# Altium project AirConditioning1.2.PrjPCB
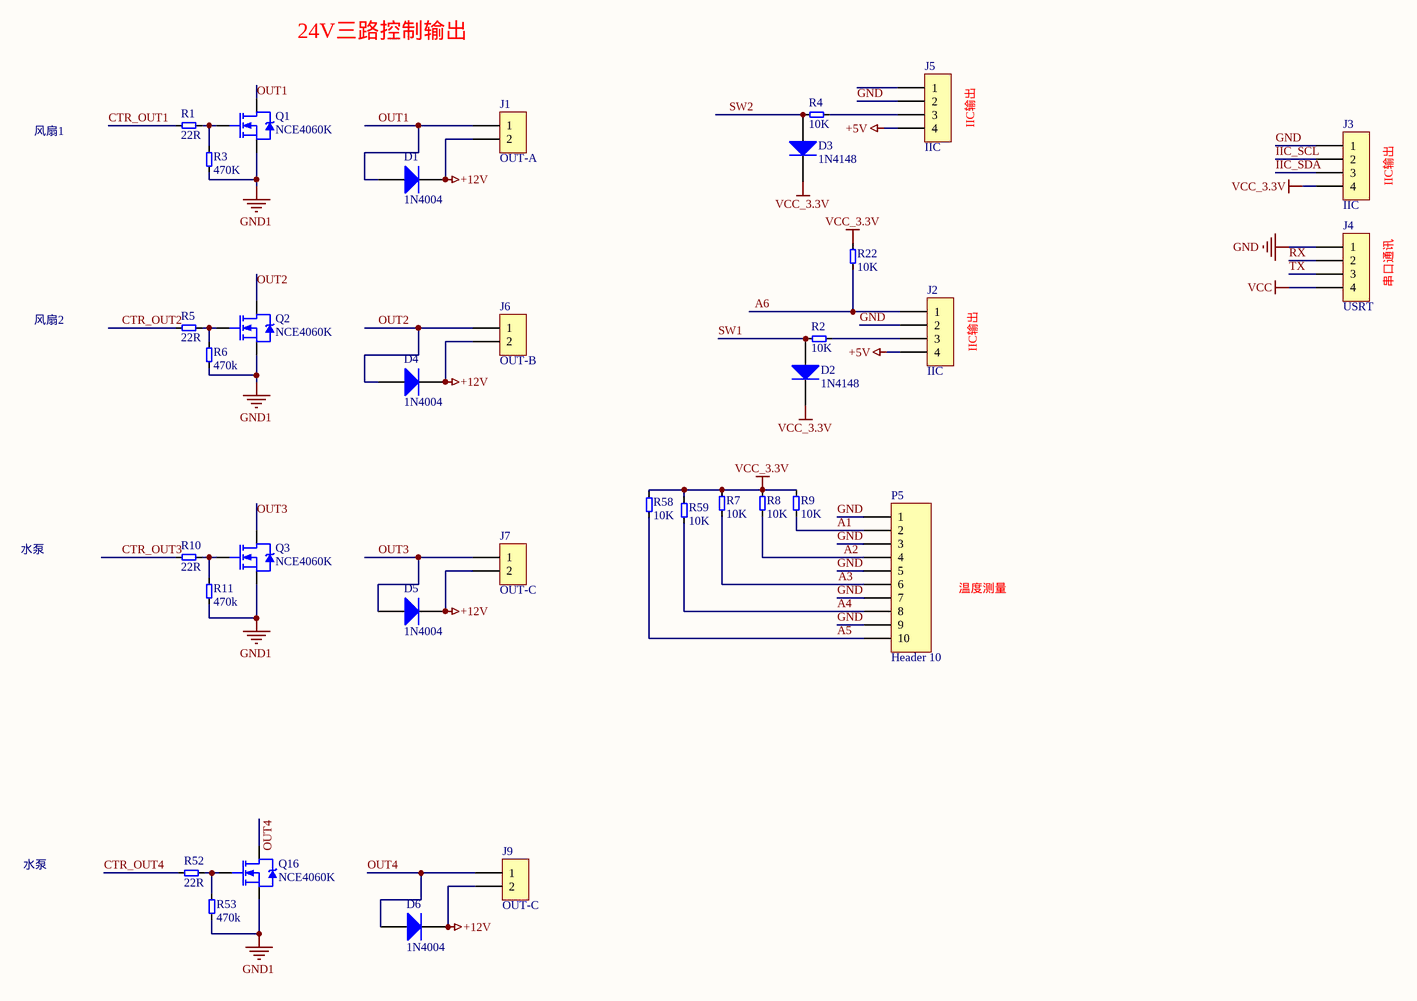
[diagram p0: Connector.SchDoc]
4 sheets, 158 parts. Net scope: global (net labels, ports and power ports of the same name join across sheets).
Board file: PCB1.PcbDoc
Sheets:
  Connector.SchDoc
  cpu.SchDoc
  Humidifier.SchDoc
  POWER.SchDoc

## Sheet Connector.SchDoc
size A3

### Parts
D1  1N4004  [D7227]
D2  1N4148  [sod323]
D3  1N4148  [sod323]
D4  1N4004  [D7227]
D5  1N4004  [D7227]
D6  1N4004  [D7227]
J1  OUT-A  [SIP-2L]
J2  IIC  [SIP-4L]
J3  IIC  [SIP-4L]
J4  USRT  [SIP-4L]
J5  IIC  [SIP-4L]
J6  OUT-B  [SIP-2L]
J7  OUT-C  [SIP-2L]
J9  OUT-C  [SIP-2L]
P5  Header 10  [SIP-10L]
Q1  NCE4060K  [TO-252-3S]
Q2  NCE4060K  [TO-252-3S]
Q3  NCE4060K  [TO-252-3S]
Q16  NCE4060K  [TO-252-3S]
R1  22R  [0805R]
R2  10K  [0805R]
R3  470K  [0805R]
R4  10K  [0805R]
R5  22R  [0805R]
R6  470k  [0805R]
R7  10K  [0805R]
R8  10K  [0805R]
R9  10K  [0805R]
R10  22R  [0805R]
R11  470k  [0805R]
R22  10K  [0805R]
R52  22R  [0805R]
R53  470k  [0805R]
R58  10K  [0805R]
R59  10K  [0805R]

### Nets
+5V: J2.4 J5.4
+12V: D1.K D4.K D5.K D6.K J1.2 J6.2 J7.2 J9.2
GND: J2.2 J3.1 J4.1 J5.2 P5.1 P5.3 P5.5 P5.7 P5.9 Q1.3(S) Q2.3(S) Q3.3(S) Q16.3(S) R3.1 R6.1 R11.1 R53.1  [also labelled GND1]
VCC: J4.4
VCC_3.3V: D2.K D3.K J3.4 R7.2 R8.2 R9.2 R22.2 R58.2 R59.1
A1: P5.2 R9.1
A2: P5.4 R8.1
A3: P5.6 R7.1
A4: P5.8 R59.2
A5: P5.10 R58.1
A6: J2.1 R22.1
CTR_OUT1: R1.1
CTR_OUT2: R5.1
CTR_OUT3: R10.1
CTR_OUT4: R52.1
IIC_SCL: J3.2
IIC_SDA: J3.3
OUT1: D1.A J1.1 Q1.2(D)
OUT2: D4.A J6.1 Q2.2(D)
OUT3: D5.A J7.1 Q3.2(D)
OUT4: D6.A J9.1 Q16.2(D)
RX: J4.2
SW1: D2.A R2.2
SW2: D3.A R4.2
TX: J4.3
NetJ2_3: J2.3 R2.1
NetJ5_3: J5.3 R4.1
NetQ1_1: Q1.1(G) R1.2 R3.2
NetQ2_1: Q2.1(G) R5.2 R6.2
NetQ3_1: Q3.1(G) R10.2 R11.2
NetQ16_1: Q16.1(G) R52.2 R53.2

Not connected (* = marked no-connect by the designer): J5 1

### Notes on the sheet
- 24V三路控制输出
- 风扇1
- (near J5) IIC输出
- (near J3) IIC输出
- (near J4) 串口通讯
- 风扇2
- (near J2) IIC输出
- 水泵
- 温度测量

### Library data of the parts
D1 D4-D6 = Diode_2: Default Diode; Published: 8-Jun-2000; LatestRevisionDate: 17-Jul-2002; LatestRevisionNote: Re-released for DXP Platform.; PackageVersion: Sep-1996; PackageReference: SMC; Publisher: Altium Limited; PackageDescription: DO-214-AB/SMC; 2 C-Bend Leads; Body 7.9 x 5.9 mm, inc. leads (LxW); Code_JEDEC: DO-214-AB
D2 D3 = Diode: Default Diode; Published: 8-Jun-2000; LatestRevisionDate: 17-Jul-2002; LatestRevisionNote: Re-released for DXP Platform.; PackageVersion: Sep-1996; PackageReference: SMC; Publisher: Altium Limited; Code_JEDEC: DO-214-AB
J1 J6 J7 J9 = CON2: Connector
J2-J5 = SIP4-2.54: CN-SIP4-2.54
P5 = Header 10: Header, 10-Pin; LatestRevisionDate: 17-Jul-2002; LatestRevisionNote: Re-released for DXP Platform.; Publisher: Altium Limited
Q1-Q3 Q16 = NCE4060K: NMOSFET
R1-R11 R22 R52 R53 R58 R59 = 1K: CR85-102J

## Sheet cpu.SchDoc
size A3
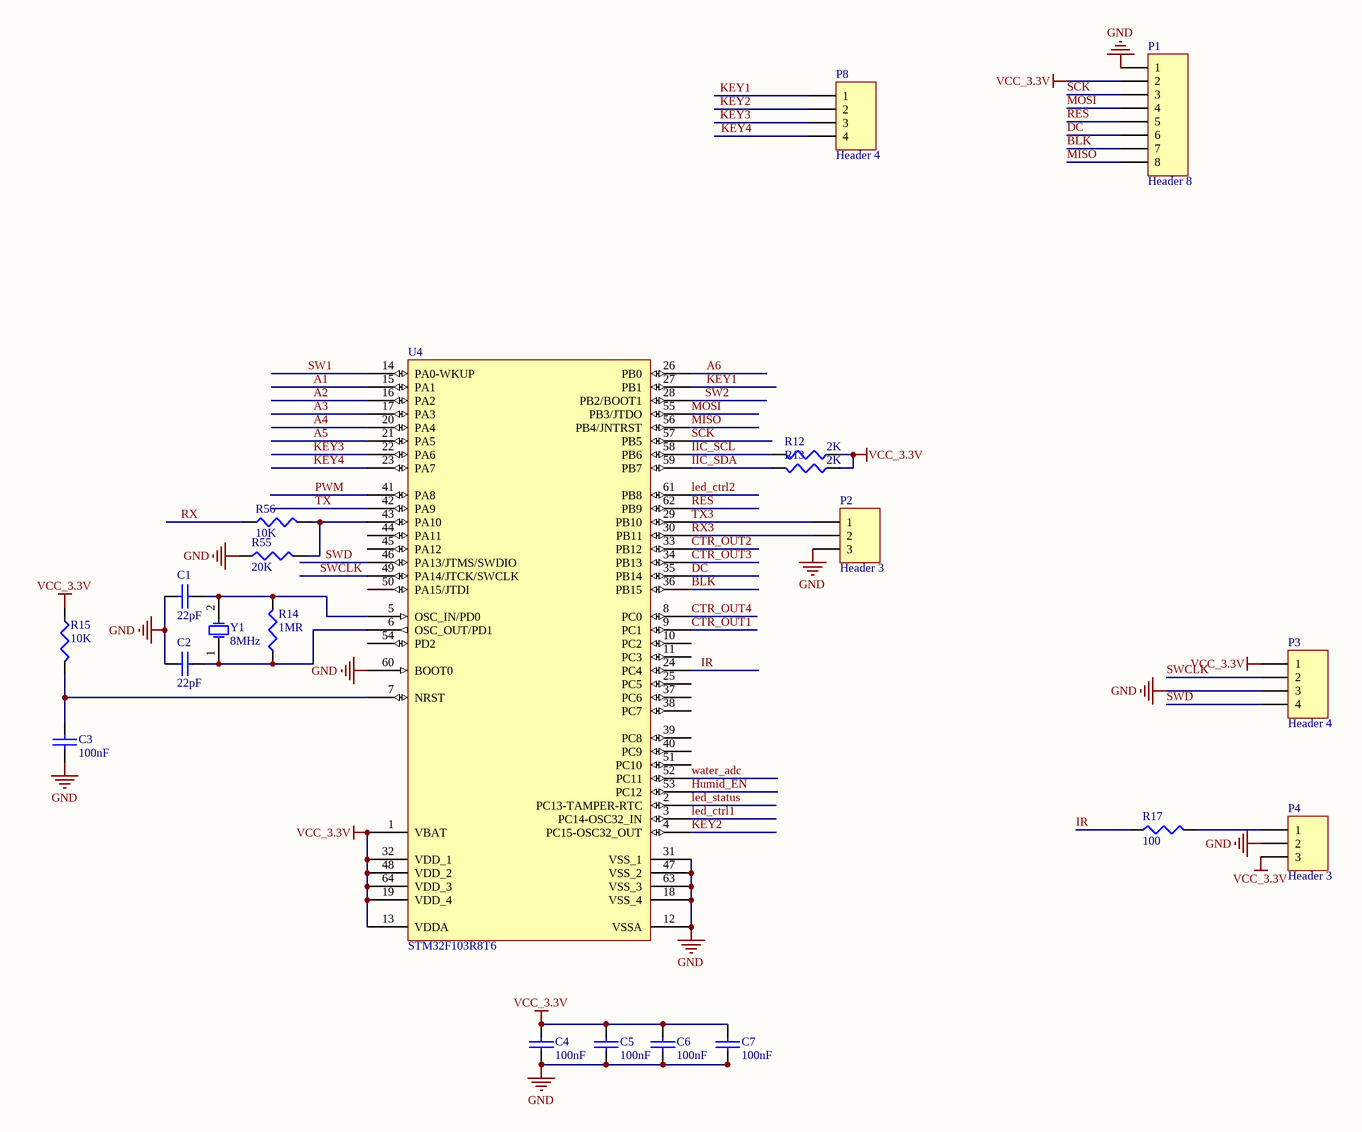
[diagram p1: cpu.SchDoc]

### Parts
C1  22pF  [0805c]
C2  22pF  [0805c]
C3  100nF  [0805c]
C4  100nF  [0805c]
C5  100nF  [0805c]
C6  100nF  [0805c]
C7  100nF  [0805c]
P1  Header 8  [HDR1X8]
P2  Header 3  [HDR1X3]
P3  Header 4  [HDR1X4]
P4  Header 3  [HDR1X3]
P8  Header 4  [HDR1X4]
R12  2K  [0805R]
R13  2K  [0805R]
R14  1MR  [0805R]
R15  10K  [0805R]
R17  100  [0805R]
R55  20K  [0805R]
R56  10K  [0805R]
U4  STM32F103R8T6  [LQFP-64]
Y1  8MHz  [SMT5032]

### Nets
GND: C1.1 C2.1 C3.1 C4.1 C5.1 C6.1 C7.1 P1.1 P2.3 P3.3 P4.2 R55.1 U4.12(VSSA) U4.18(VSS_4) U4.31(VSS_1) U4.47(VSS_2) U4.60(BOOT0) U4.63(VSS_3)
VCC_3.3V: C4.2 C5.2 C6.2 C7.2 P1.2 P3.1 P4.3 R12.1 R13.1 R15.1 U4.1(VBAT) U4.13(VDDA) U4.19(VDD_4) U4.32(VDD_1) U4.48(VDD_2) U4.64(VDD_3)
A1: U4.15(PA1)
A2: U4.16(PA2)
A3: U4.17(PA3)
A4: U4.20(PA4)
A5: U4.21(PA5)
A6: U4.26(PB0)
BLK: P1.7 U4.36(PB15)
CTR_OUT1: U4.9(PC1)
CTR_OUT2: U4.33(PB12)
CTR_OUT3: U4.34(PB13)
CTR_OUT4: U4.8(PC0)
DC: P1.6 U4.35(PB14)
Humid_EN: U4.53(PC12)
IIC_SCL: R12.2 U4.58(PB6)
IIC_SDA: R13.2 U4.59(PB7)
IR: R17.1 U4.24(PC4)
KEY1: P8.1 U4.27(PB1)
KEY2: P8.2 U4.4(PC15-OSC32_OUT)
KEY3: P8.3 U4.22(PA6)
KEY4: P8.4 U4.23(PA7)
led_ctrl1: U4.3(PC14-OSC32_IN)
led_ctrl2: U4.61(PB8)
led_status: U4.2(PC13-TAMPER-RTC)
MISO: P1.8 U4.56(PB4/JNTRST)
MOSI: P1.4 U4.55(PB3/JTDO)
PWM: U4.41(PA8)
RES: P1.5 U4.62(PB9)
RX: R56.1
RX3: P2.2 U4.30(PB11)
SCK: P1.3 U4.57(PB5)
SW1: U4.14(PA0-WKUP)
SW2: U4.28(PB2/BOOT1)
SWCLK: P3.2 U4.49(PA14/JTCK/SWCLK)
SWD: P3.4 U4.46(PA13/JTMS/SWDIO)
TX: U4.42(PA9)
TX3: P2.1 U4.29(PB10)
water_adc: U4.52(PC11)
NetC1_2: C1.2 R14.2 U4.5(OSC_IN/PD0) Y1.2(OSC2)
NetC2_2: C2.2 R14.1 U4.6(OSC_OUT/PD1) Y1.1(OSC1)
NetC3_2: C3.2 R15.2 U4.7(NRST)
NetP4_1: P4.1 R17.2
NetR55_2: R55.2 R56.2 U4.43(PA10)

Not connected (* = marked no-connect by the designer): U4 10(PC2) 11(PC3) 25(PC5) 37(PC6) 38(PC7) 39(PC8) 40(PC9) 44(PA11) 45(PA12) 50(PA15/JTDI) 51(PC10) 54(PD2)

### Library data of the parts
C1-C7 = CAP: Capacitor
P1 = Header 8: Header, 8-Pin; LatestRevisionDate: 17-Jul-2002; LatestRevisionNote: Re-released for DXP Platform.; Publisher: Altium Limited
P2 P4 = Header 3: Header, 3-Pin; LatestRevisionDate: 17-Jul-2002; LatestRevisionNote: Re-released for DXP Platform.; Publisher: Altium Limited
P3 P8 = Header 4: Header, 4-Pin; LatestRevisionDate: 17-Jul-2002; LatestRevisionNote: Re-released for DXP Platform.; Publisher: Altium Limited
R12-R15 R17 R55 R56 = Res3: Resistor; Published: 8-Jun-2000; LatestRevisionDate: 29-May-2009; LatestRevisionNote: IPC-7351 Footprint Added.; PackageReference: J1-0603; Publisher: Altium Limited; PackageDescription: Chip Resistor
U4 = STM32F103R8T6: STM32 ARM-based 32-bit MCU with 64 Kbytes Flash, 64-pin LQFP, Industrial Temperature; Published: 30-May-2008; DatasheetVersion: rev6, Mar-2008; PackageVersion: Mar-2008; PackageReference: LQFP64; Publisher: Altium Limited; PackageDescription: 64-Pin Low-Profile Quad Flat Pack, 10 x 10 mm Body, 0.5 mm Pitch (LQFP64); ComponentLink1Description: Manufacturer Link; ComponentLink1URL: www.st.com/stm32; ComponentLink2Description: Datasheet; ComponentLink2URL: http://www.st.com/stonline/products/literature/ds/13587.pdf
Y1 = XTAL: Crystal Oscillator; Published: 8-Jun-2000; LatestRevisionDate: 17-Jul-2002; LatestRevisionNote: Re-released for DXP Platform.; PackageReference: R38; Publisher: Altium Limited; PackageDescription: Crystal, Thru-Hole; 2 Leads; Body 3.1 x 8.2 mm (Dia.xH)

## Sheet Humidifier.SchDoc
size A2
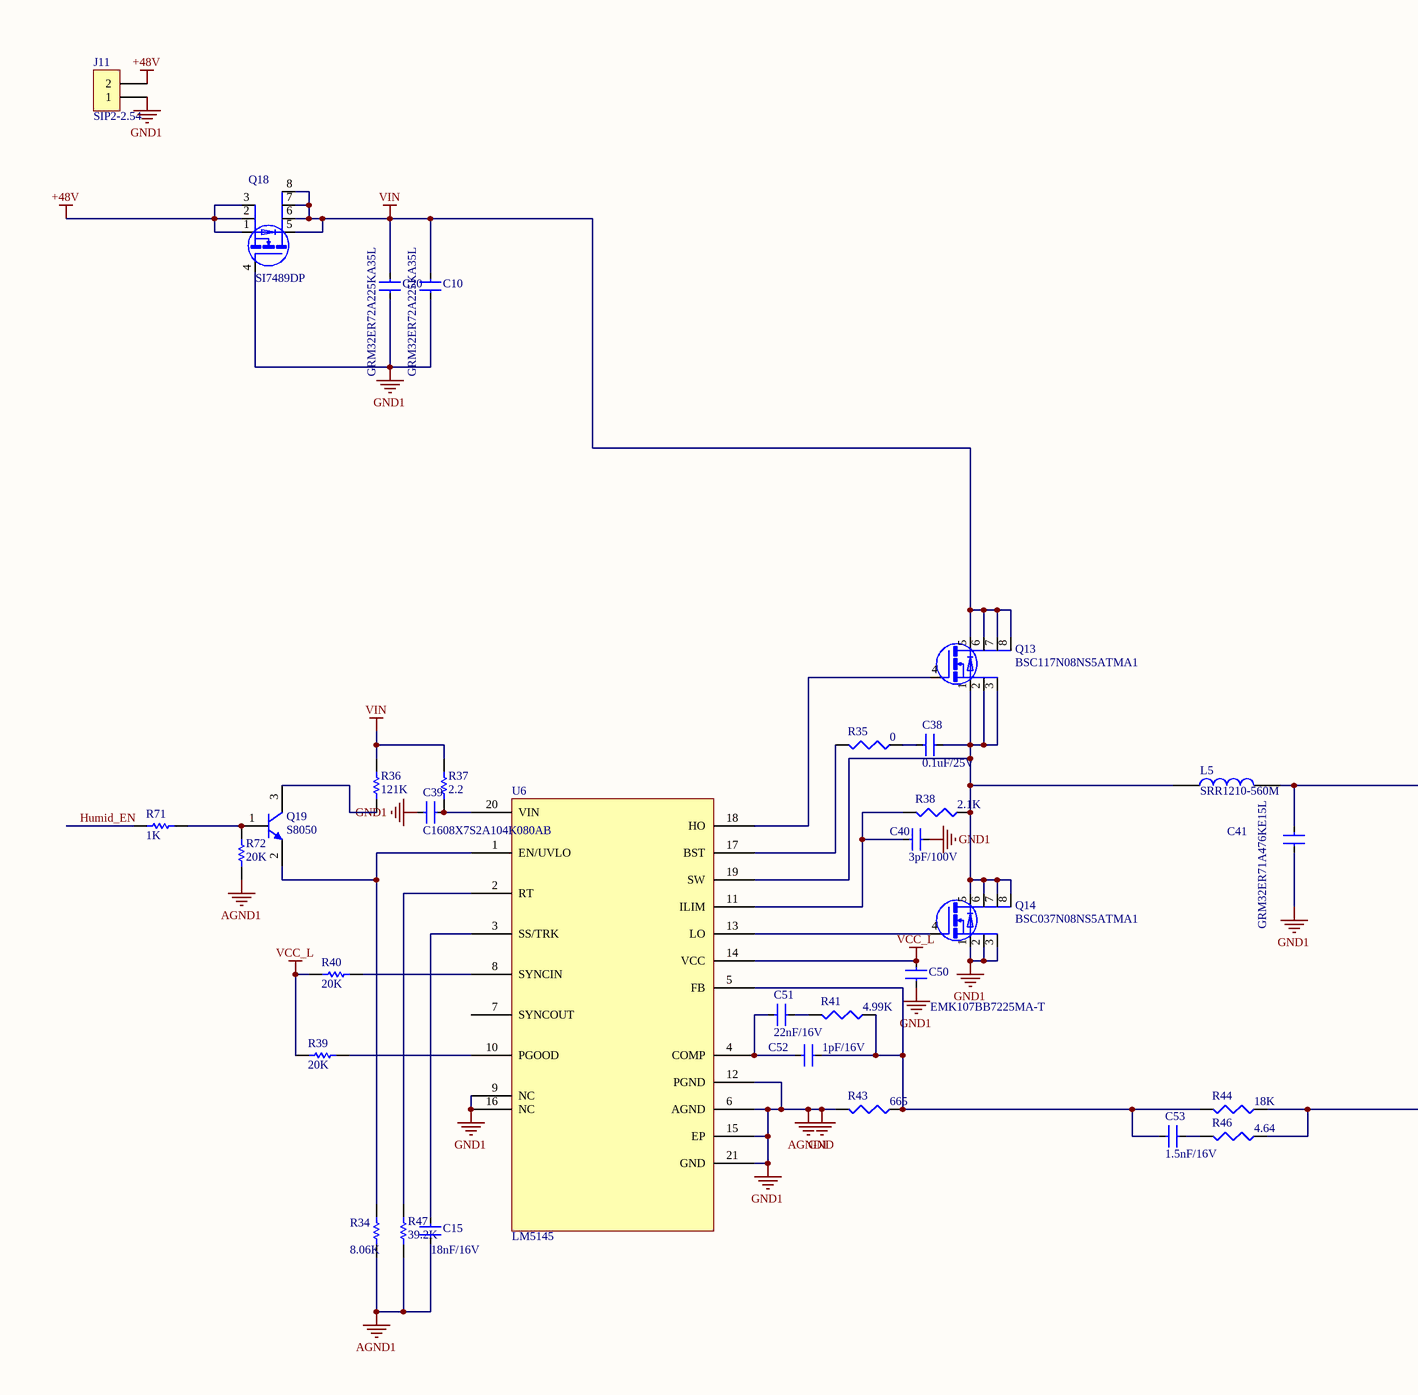
[diagram p2: Humidifier.SchDoc, left]
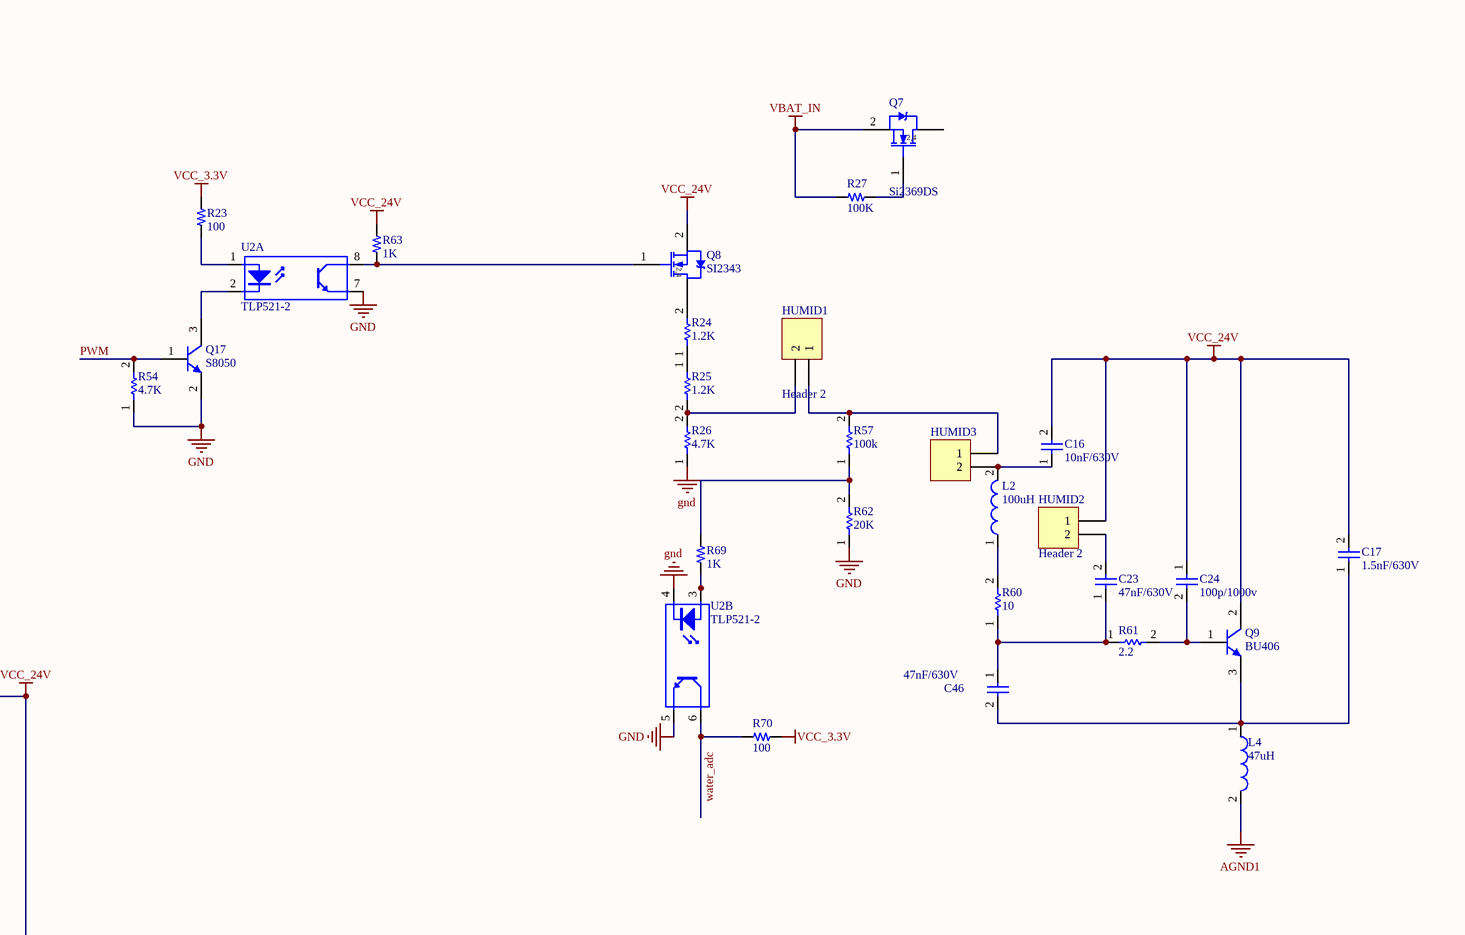
[diagram p3: Humidifier.SchDoc, right]

### Parts
(Parts that share a designator on the sheet are numbered #1, #2 ... from top to bottom, then left to right.)
C10  GRM32ER72A225KA35L  [1210C]
C15  18nF/16V  [0603C]
C16  10nF/630V  [CAP_5MM]
C17  1.5nF/630V  [AXIAL-0.3]
C20  GRM32ER72A225KA35L  [1210C]
C23  47nF/630V  [AXIAL-0.4]
C24  100p/1000v  [CAP_5MM]
C38  0.1uF/25V  [0603C]
C39  C1608X7S2A104K080AB  [0603C]
C40  3pF/100V  [0603C]
C41  GRM32ER71A476KE15L  [1210C]
C46  47nF/630V  [AXIAL-0.4]
C50  EMK107BB7225MA-T  [0603C]
C51  22nF/16V  [0603C]
C52  1pF/16V  [0603C]
C53  1.5nF/16V  [0603C]
HUMID1  Header 2  [SIP-2L]
HUMID2  Header 2  [SIP-2L]
HUMID3  (no value)  [SIP-2L]
J11  SIP2-2.54  [CH3.96-2P]
L2  100uH  [AXIAL-0.5]
L4  47uH  [6*8]
L5  SRR1210-560M  [SRR1210]
Q7  Si2369DS  [SOT23-3]
Q8  SI2343  [SOT23-3]
Q9  BU406  [to220]
Q13  BSC117N08NS5ATMA1  [PowerPAK SO-8]
Q14  BSC037N08NS5ATMA1  [PowerPAK SO-8]
Q17  S8050  [SOT23-3]
Q18  SI7489DP  [PowerPAK SO-8]
Q19  S8050  [SOT23-3]
R23  100  [0603R]
R24  1.2K  [AXIAL-0.4]
R25  1.2K  [AXIAL-0.4]
R26  4.7K  [AXIAL-0.4]
R27#1  100K  [0603R]
R34  8.06K  [0603R]
R35  0  [0603R]
R36  121K  [0805R]
R37  2.2  [0603R]
R38  2.1K  [0603R]
R39  20K  [0603R]
R40  20K  [0603R]
R41  4.99K  [0603R]
R43  665  [0603R]
R44  18K  [0603R]
R46  4.64  [0603R]
R47  39.2K  [0603R]
R54  4.7K  [0603r]
R57  100k  [0603r]
R60  10  [AXIAL-0.4]
R61  2.2  [AXIAL-0.4]
R62  20K  [0603r]
R63  1K  [0603R]
R69  1K  [0603R]
R70  100  [0603R]
R71  1K  [0603R]
R72  20K  [0603R]
U2  TLP521-2  [SO-8]  (parts A,B of 2)
U6  LM5145  [QFN050P600-8N]

### Nets
+48V: J11.2 Q18.1(S) Q18.2(S) Q18.3(S)
GND: C10.2 C15.2 C20.2 C39.1 C40.1 C41.2 C50.2 J11.1 L4.2 Q14.1(S) Q14.2(S) Q14.3(S) Q17.2(E) Q18.4(G) R26.1 R34.1 R43.2 R47.1 R54.1 R62.1 R72.2 U2.4(K) U2.5(E) U2.7(E) U6.6(AGND) U6.9(NC) U6.12(PGND) U6.15(EP) U6.16(NC) U6.21(GND)  [also labelled AGND1, GND1]
VBAT_IN: Q7.2(S) R27#1.1
VCC_3.3V: R23.2 R70.2
VCC_24V: C16.2 C17.2 C24.1 C41.1 HUMID2.1 L5.2 Q8.2(S) Q9.2(C) R44.1 R46.1 R63.2
VCC_L: C50.1 R39.2 R40.2 U6.14(VCC)
VIN: C10.1 C20.1 Q13.5(D) Q13.6(D) Q13.7(D) Q13.8(D) Q18.5(D) Q18.6(D) Q18.7(D) Q18.8(D) R36.2 R37.1
Humid_EN: R71.1
PWM: Q17.1(B) R54.2
water_adc: R70.1 U2.6(C)
NetC15_1: C15.1 U6.3(SS/TRK)
NetC16_1: C16.1 HUMID3.2 L2.2
NetC17_1: C17.1 C46.2 L4.1 Q9.3(E)
NetC23_1: C23.1 C46.1 R60.1 R61.1
NetC23_2: C23.2 HUMID2.2
NetC24_2: C24.2 Q9.1(B) R61.2
NetC38_1: C38.1 R35.1
NetC38_2: C38.2 L5.1 Q13.1(S) Q13.2(S) Q13.3(S) Q14.5(D) Q14.6(D) Q14.7(D) Q14.8(D) R38.1 U6.19(SW)
NetC39_2: C39.2 R37.2 U6.20(VIN)
NetC40_2: C40.2 R38.2 U6.11(ILIM)
NetC51_1: C51.1 C52.1 U6.4(COMP)
NetC51_2: C51.2 R41.2
NetC52_2: C52.2 C53.1 R41.1 R43.1 R44.2 U6.5(FB)
NetC53_2: C53.2 R46.2
NetHUMID1_1: HUMID1.1 HUMID3.1 R57.2
NetHUMID1_2: HUMID1.2 R25.2 R26.2
NetL2_1: L2.1 R60.2
NetQ7_1: Q7.1(G) R27#1.2
NetQ8_1: Q8.1(G) R63.1 U2.8(C)
NetQ8_3: Q8.3(D) R24.2
NetQ13_4: Q13.4(G) U6.18(HO)
NetQ14_4: Q14.4(G) U6.13(LO)
NetQ17_3: Q17.3(C) U2.2(K)
NetQ19_1: Q19.1(B) R71.2 R72.1
NetQ19_2: Q19.2(E) R34.2 U6.1(EN/UVLO)
NetQ19_3: Q19.3(C) R36.1
NetR23_1: R23.1 U2.1(A)
NetR24_1: R24.1 R25.1
NetR35_2: R35.2 U6.17(BST)
NetR39_1: R39.1 U6.10(PGOOD)
NetR40_1: R40.1 U6.8(SYNCIN)
NetR47_2: R47.2 U6.2(RT)
NetR57_1: R57.1 R62.2 R69.2
NetR69_1: R69.1 U2.3(A)

Not connected (* = marked no-connect by the designer): Q7 3(D); U6 7(SYNCOUT)

### Notes on the sheet
- (in symbol BUK92150-55A) 2,4

### Library data of the parts
C10 C15 C20 C38-C41 C50-C53 = 0.01UF: CCX85-103
C16 C17 C23 C24 C46 = Cap: Capacitor; Value: 1nF/100V; Published: 8-Jun-2000; LatestRevisionDate: 17-Jul-2002; LatestRevisionNote: Re-released for DXP Platform.; PackageReference: RAD-0.3; Publisher: Altium Limited
HUMID1-HUMID3 = Header 2: Header, 2-Pin; LatestRevisionDate: 17-Jul-2002; LatestRevisionNote: Re-released for DXP Platform.; Publisher: Altium Limited
J11 = SIP2-2.54: CN-SIP2-2.54
L2 L4 = Inductor: Code_IEC: 1005; Value: 10uH; Published: 8-Jun-2000; LatestRevisionDate: 29-May-2009; LatestRevisionNote: IPC-7351 Footprint Added.; PackageReference: 0402-A; Publisher: Altium Limited; PackageDescription: Chip Inductor; Code_JEITA: 0402
L5 = INDUCTOR
Q7 Q8 = BUK92150-55A: Published: 8-Jun-2000; LatestRevisionDate: 17-Jul-2002; LatestRevisionNote: Re-released for DXP Platform.; DatasheetVersion: 6-Oct-1997; PackageVersion: Aug-1998; PackageReference: TSOP-6; Publisher: Altium Limited; PackageDescription: SOT-457/SC-74; 6 Leads; Body 3.1 x 3 mm, inc. leads (LxW max); ComponentLink1Description: Manufacturer Link; ComponentLink1URL: http://www.vishay.com/; ComponentLink2Description: Datasheet; ComponentLink2URL: http://www.vishay.com/docs/70192/70192.pdf
Q9 = NPN: NPN Bipolar Transistor; Published: 8-Jun-2000; LatestRevisionDate: 17-Jul-2002; LatestRevisionNote: Re-released for DXP Platform.; PackageReference: TO-226; Publisher: Altium Limited; Code_JEDEC: TO-226-AA
Q13 Q14 Q18 = Si4004DY
Q17 Q19 = NPN
R23 R27#1 R63 R69 R70 = R
R24-R26 R34 R36 R37 R39 R40 R47 R54 R57 R60-R62 R72 = Res Semi: Semiconductor Resistor; Value: 1K; Published: 8-Jun-2000; LatestRevisionDate: 17-Jul-2002; LatestRevisionNote: Re-released for DXP Platform.; PackageReference: AXIAL-0.5; Publisher: Altium Limited
R35 R38 R41 R43 R44 R46 = Res3: Resistor; Published: 8-Jun-2000; LatestRevisionDate: 29-May-2009; LatestRevisionNote: IPC-7351 Footprint Added.; PackageReference: J1-0603; Publisher: Altium Limited; PackageDescription: Chip Resistor
R71 = Res Semi: Semiconductor Resistor; Published: 8-Jun-2000; LatestRevisionDate: 17-Jul-2002; LatestRevisionNote: Re-released for DXP Platform.; PackageReference: AXIAL-0.5; Publisher: Altium Limited; Value: 1K

## Sheet POWER.SchDoc
size A3
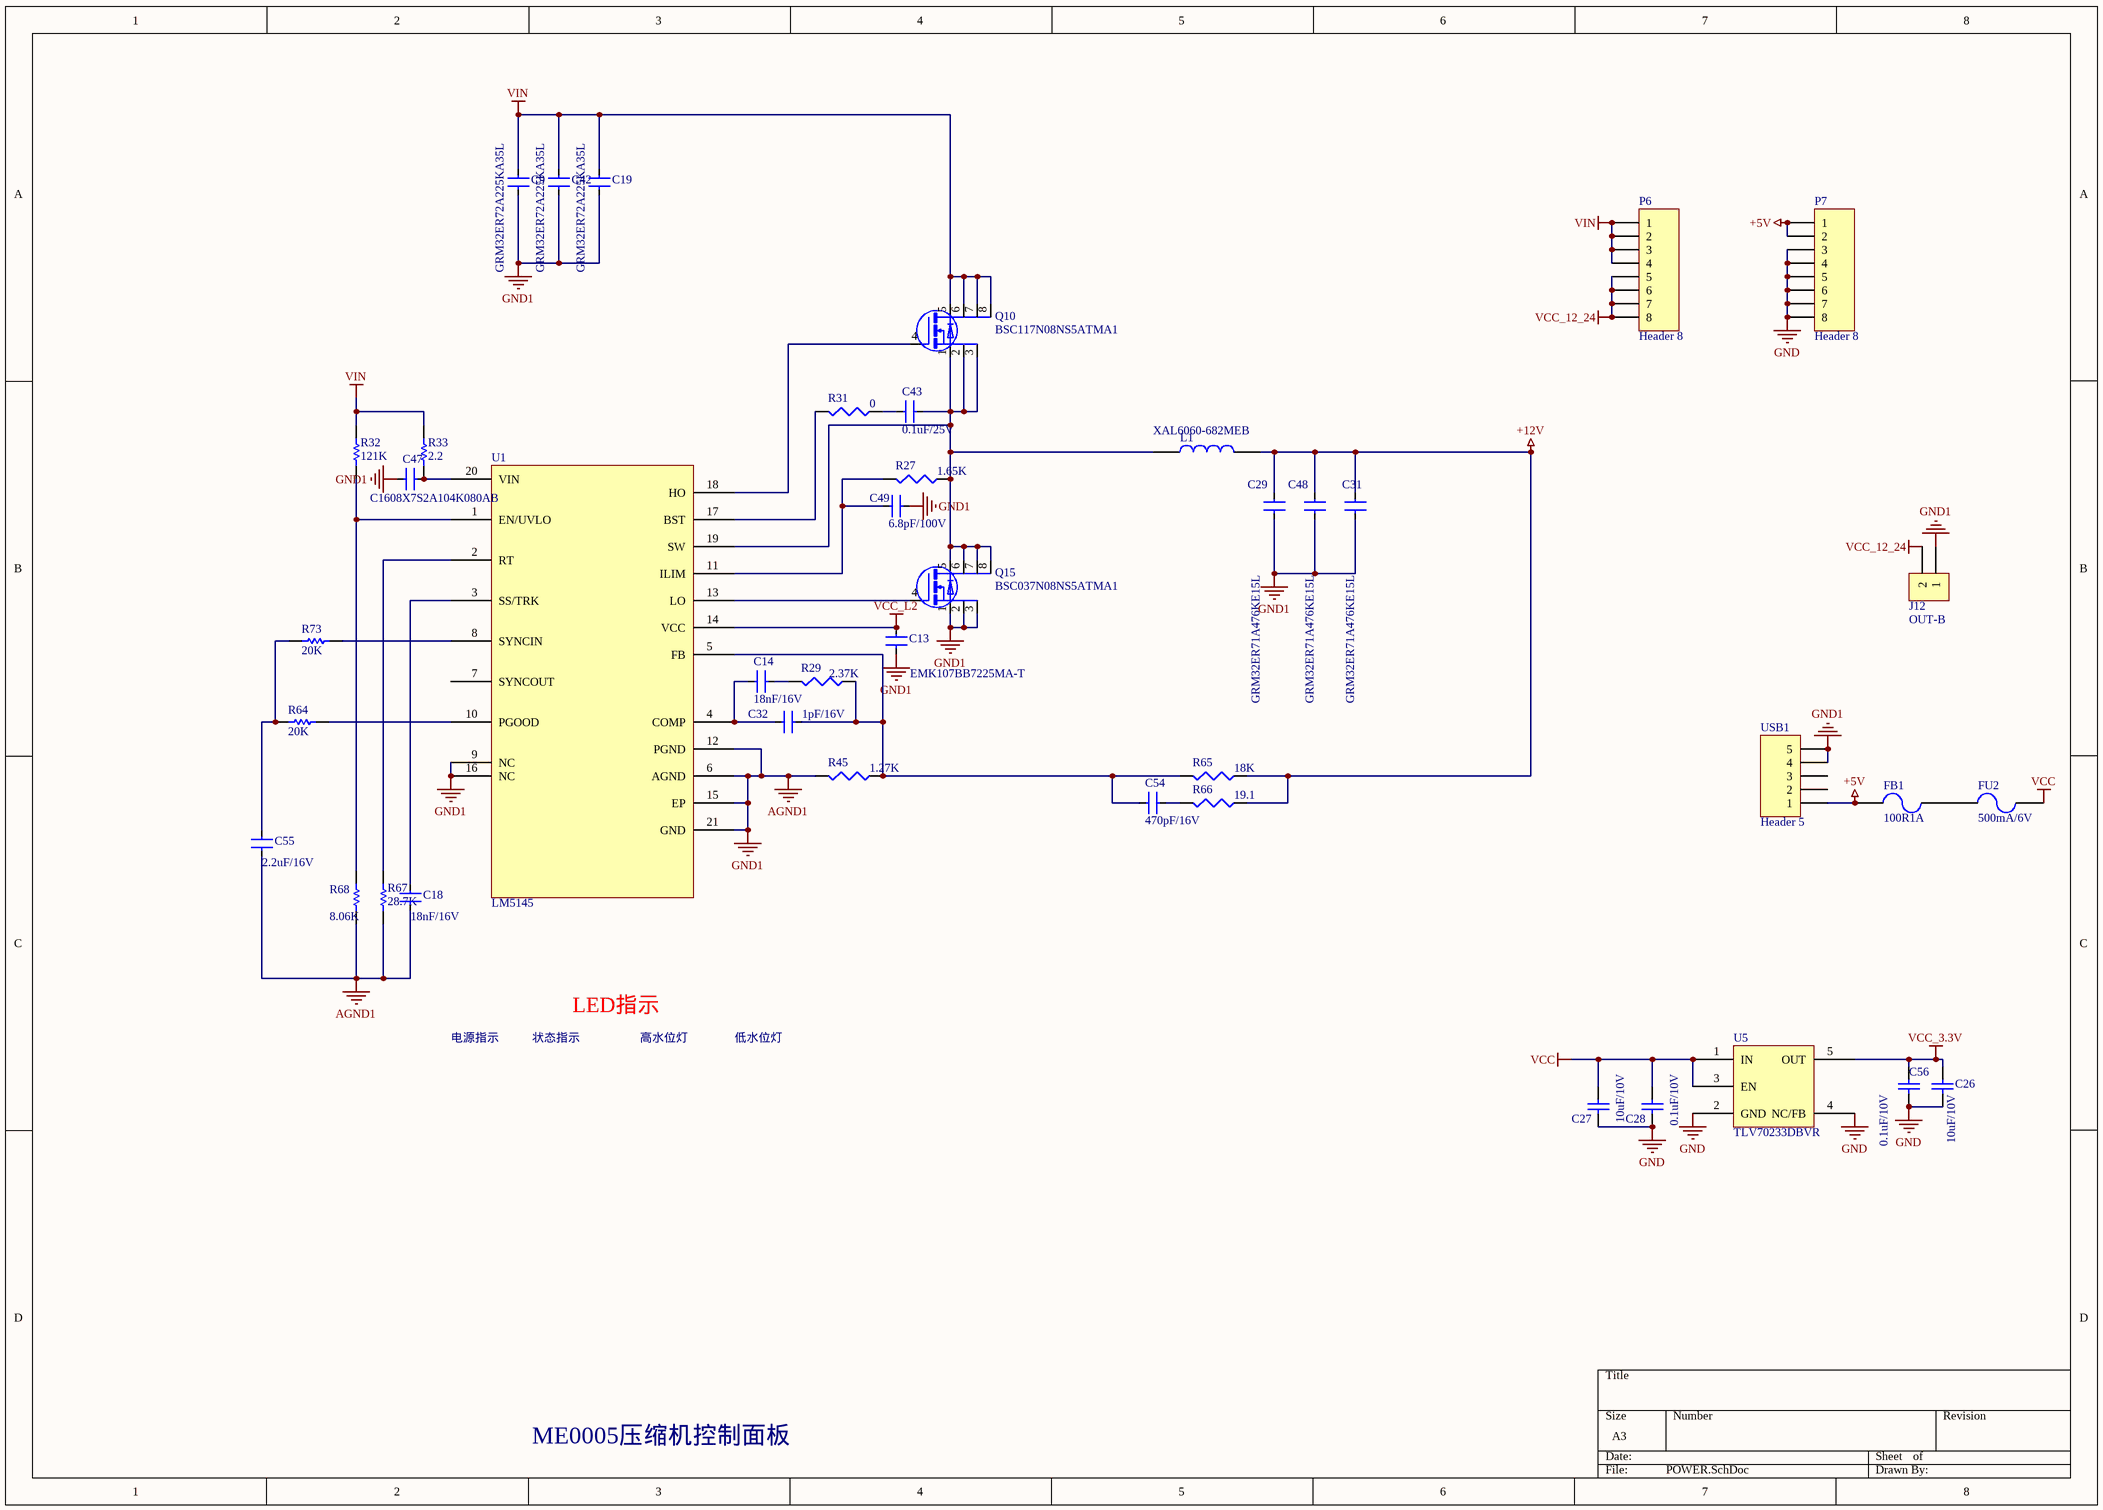
[diagram p4: POWER.SchDoc]

### Parts
(Parts that share a designator on the sheet are numbered #1, #2 ... from top to bottom, then left to right.)
C9  GRM32ER72A225KA35L  [1210C]
C13  EMK107BB7225MA-T  [0603C]
C14  18nF/16V  [0603C]
C18  18nF/16V  [0603C]
C19  GRM32ER72A225KA35L  [1210C]
C26  10uF/10V  [0603C]
C27  10uF/10V  [0603C]
C28  0.1uF/10V  [0603C]
C29  GRM32ER71A476KE15L  [1210C]
C31  GRM32ER71A476KE15L  [1210C]
C32  1pF/16V  [0603C]
C42  GRM32ER72A225KA35L  [1210C]
C43  0.1uF/25V  [0603C]
C47  C1608X7S2A104K080AB  [0603C]
C48  GRM32ER71A476KE15L  [1210C]
C49  6.8pF/100V  [0603C]
C54  470pF/16V  [0603C]
C55  2.2uF/16V  [0603C]
C56  0.1uF/10V  [0603C]
FB1  100R1A  [F0805]
FU2  500mA/6V  [F0805]
J12  OUT-B  [CH3.96-2P]
L1  XAL6060-682MEB  [XAL6060]
P6  Header 8  [CH3.96-8P]
P7  Header 8  [CH3.96-8P]
Q10  BSC117N08NS5ATMA1  [PowerPAK SO-8]
Q15  BSC037N08NS5ATMA1  [PowerPAK SO-8]
R27#2  1.65K  [0603R]
R29  2.37K  [0603R]
R31  0  [0603R]
R32  121K  [0805R]
R33  2.2  [0603R]
R45  1.27K  [0603R]
R64  20K  [0603R]
R65  18K  [0603R]
R66  19.1  [0603R]
R67  28.7K  [0603R]
R68  8.06K  [0603R]
R73  20K  [0603R]
U1  LM5145  [QFN050P600-8N]
U5  TLV70233DBVR  [SOT23-5(DBV)]
USB1  Header 5  [USB-A]

### Nets
+5V: FB1.1 P7.1 P7.2 USB1.1
+12V: C29.1 C31.1 C48.1 L1.2 R65.1 R66.1
GND: C9.2 C13.2 C18.2 C19.2 C26.1 C27.1 C28.2 C29.2 C31.2 C42.2 C47.1 C48.2 C49.1 C55.2 C56.2 J12.1 P7.3 P7.4 P7.5 P7.6 P7.7 P7.8 Q15.1(S) Q15.2(S) Q15.3(S) R45.2 R67.1 R68.1 U1.6(AGND) U1.9(NC) U1.12(PGND) U1.15(EP) U1.16(NC) U1.21(GND) U5.2(GND) U5.4(NC/FB) USB1.4 USB1.5  [also labelled AGND1, GND1]
VCC: C27.2 C28.1 FU2.2 U5.1(IN) U5.3(EN)
VCC_3.3V: C26.2 C56.1 U5.5(OUT)
VCC_12_24: J12.2 P6.5 P6.6 P6.7 P6.8
VCC_L2: C13.1 U1.14(VCC)
VIN: C9.1 C19.1 C42.1 P6.1 P6.2 P6.3 P6.4 Q10.5(D) Q10.6(D) Q10.7(D) Q10.8(D) R32.2 R33.1
NetC14_1: C14.1 C32.1 U1.4(COMP)
NetC14_2: C14.2 R29.2
NetC18_1: C18.1 U1.3(SS/TRK)
NetC32_2: C32.2 C54.1 R29.1 R45.1 R65.2 U1.5(FB)
NetC43_1: C43.1 R31.1
NetC43_2: C43.2 L1.1 Q10.1(S) Q10.2(S) Q10.3(S) Q15.5(D) Q15.6(D) Q15.7(D) Q15.8(D) R27#2.1 U1.19(SW)
NetC47_2: C47.2 R33.2 U1.20(VIN)
NetC49_2: C49.2 R27#2.2 U1.11(ILIM)
NetC54_2: C54.2 R66.2
NetC55_1: C55.1 R64.2 R73.2
NetFB1_2: FB1.2 FU2.1
NetQ10_4: Q10.4(G) U1.18(HO)
NetQ15_4: Q15.4(G) U1.13(LO)
NetR31_2: R31.2 U1.17(BST)
NetR32_1: R32.1 R68.2 U1.1(EN/UVLO)
NetR64_1: R64.1 U1.10(PGOOD)
NetR67_2: R67.2 U1.2(RT)
NetR73_1: R73.1 U1.8(SYNCIN)

Not connected (* = marked no-connect by the designer): U1 7(SYNCOUT); USB1 2 3

### Notes on the sheet
- 电源指示
- 状态指示
- LED指示
- 高水位灯
- 低水位灯
- ME0005压缩机控制面板

### Library data of the parts
C9 C13 C14 C18 C19 C29 C31 C32 C42 C43 C47-C49 C54 C55 = 0.01UF: CCX85-103
C26 = Cap: Capacitor; Published: 8-Jun-2000; LatestRevisionDate: 17-Jul-2002; LatestRevisionNote: Re-released for DXP Platform.; PackageReference: RAD-0.3; Publisher: Altium Limited; Value: 10uF/10V
C27 = Cap: Capacitor; Value: 106/50V; Published: 8-Jun-2000; LatestRevisionDate: 17-Jul-2002; LatestRevisionNote: Re-released for DXP Platform.; PackageReference: RAD-0.3; Publisher: Altium Limited
C28 C56 = Cap: Capacitor; Value: 104; Published: 8-Jun-2000; LatestRevisionDate: 17-Jul-2002; LatestRevisionNote: Re-released for DXP Platform.; PackageReference: RAD-0.3; Publisher: Altium Limited
FB1 FU2 = FUSE2: Fuse
J12 = CON2: Connector
L1 = INDUCTOR
P6 P7 = Header 8: Header, 8-Pin; LatestRevisionDate: 17-Jul-2002; LatestRevisionNote: Re-released for DXP Platform.; Publisher: Altium Limited
Q10 Q15 = Si4004DY
R27#2 R29 R31 R45 R65 R66 = Res3: Resistor; Published: 8-Jun-2000; LatestRevisionDate: 29-May-2009; LatestRevisionNote: IPC-7351 Footprint Added.; PackageReference: J1-0603; Publisher: Altium Limited; PackageDescription: Chip Resistor
R32 R33 R64 R67 R68 R73 = Res Semi: Semiconductor Resistor; Value: 1K; Published: 8-Jun-2000; LatestRevisionDate: 17-Jul-2002; LatestRevisionNote: Re-released for DXP Platform.; PackageReference: AXIAL-0.5; Publisher: Altium Limited
U5 = TLV70230DBVR
USB1 = Header 5: Header, 5-Pin; LatestRevisionDate: 17-Jul-2002; LatestRevisionNote: Re-released for DXP Platform.; Publisher: Altium Limited

## Nets that join several sheets
+5V: Connector (J2.4 J5.4), POWER (FB1.1 P7.1 P7.2 USB1.1)
+12V: Connector (8 pins), POWER (6 pins)
GND: Connector (17 pins), cpu (18 pins), Humidifier (30 pins), POWER (38 pins)
VCC: Connector (J4.4), POWER (5 pins)
VCC_3.3V: Connector (9 pins), cpu (16 pins), Humidifier (R23.2 R70.2), POWER (C26.2 C56.1 U5.5)
VIN: Humidifier (12 pins), POWER (13 pins)
A1: Connector (P5.2 R9.1), cpu (U4.15)
A2: Connector (P5.4 R8.1), cpu (U4.16)
A3: Connector (P5.6 R7.1), cpu (U4.17)
A4: Connector (P5.8 R59.2), cpu (U4.20)
A5: Connector (P5.10 R58.1), cpu (U4.21)
A6: Connector (J2.1 R22.1), cpu (U4.26)
CTR_OUT1: Connector (R1.1), cpu (U4.9)
CTR_OUT2: Connector (R5.1), cpu (U4.33)
CTR_OUT3: Connector (R10.1), cpu (U4.34)
CTR_OUT4: Connector (R52.1), cpu (U4.8)
Humid_EN: cpu (U4.53), Humidifier (R71.1)
IIC_SCL: Connector (J3.2), cpu (R12.2 U4.58)
IIC_SDA: Connector (J3.3), cpu (R13.2 U4.59)
PWM: cpu (U4.41), Humidifier (Q17.1 R54.2)
RX: Connector (J4.2), cpu (R56.1)
SW1: Connector (D2.A R2.2), cpu (U4.14)
SW2: Connector (D3.A R4.2), cpu (U4.28)
TX: Connector (J4.3), cpu (U4.42)
water_adc: cpu (U4.52), Humidifier (R70.1 U2.6)